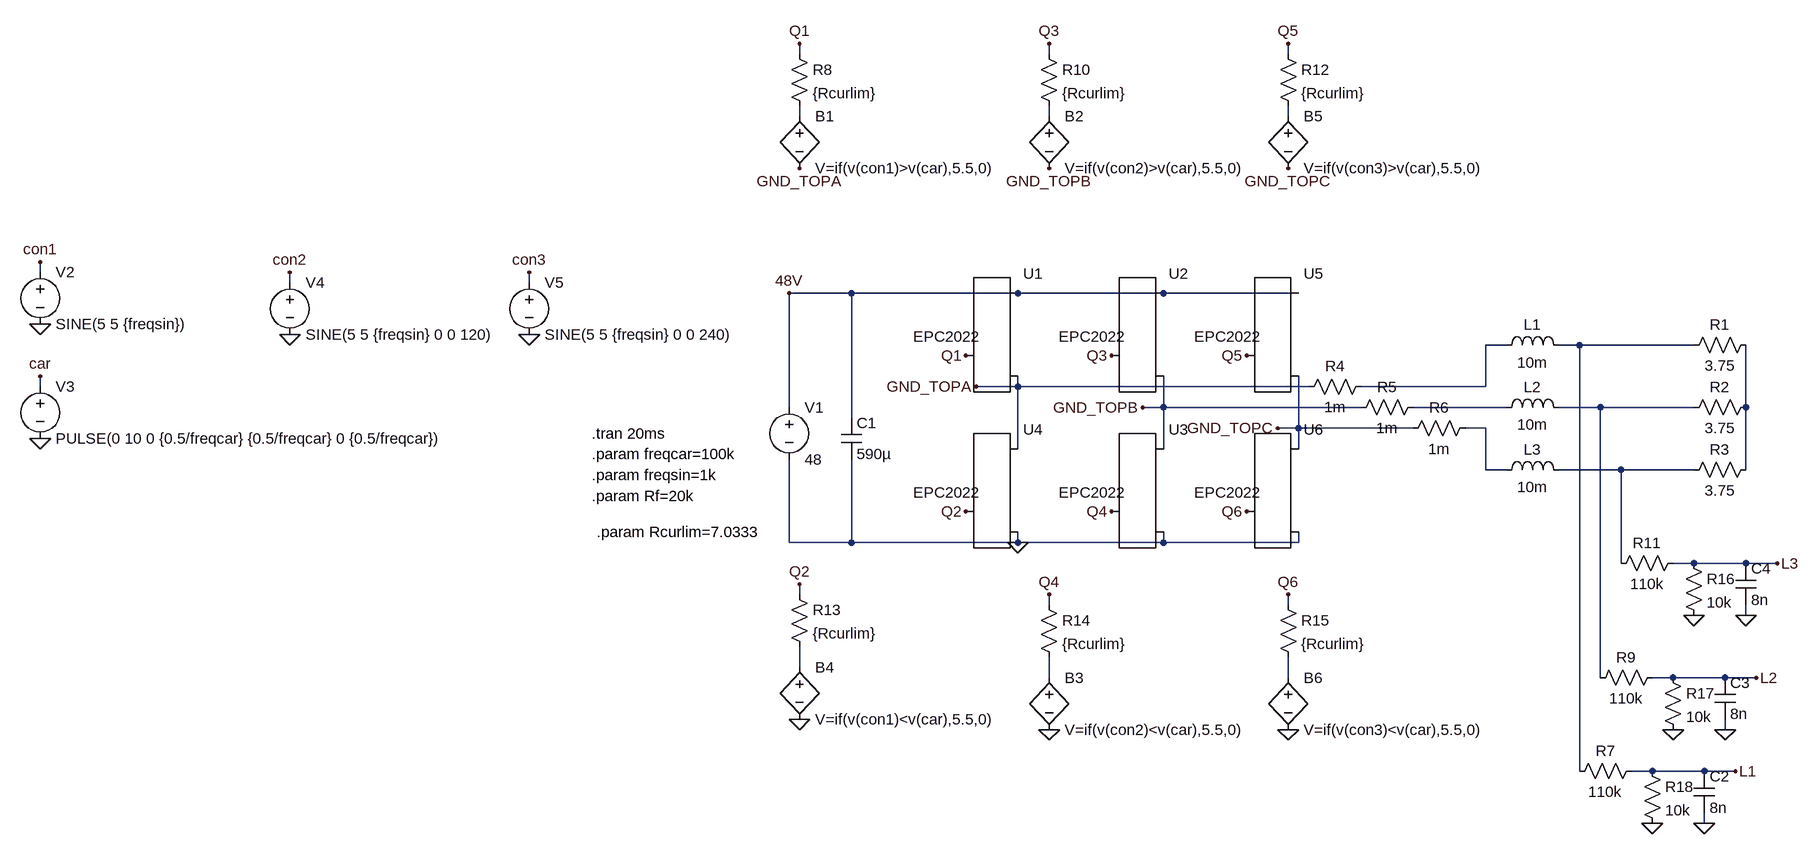
[diagram p0: schematic Threephase_EPC2022 - Kopie.asc]
Threephase_EPC2022 - Kopie.asc, the LTspice schematic file:
Version 4
SHEET 1 2244 740
WIRE -944 -560 -944 -576
WIRE -560 -560 -560 -576
WIRE -192 -560 -192 -576
WIRE -944 -464 -944 -480
WIRE -560 -464 -560 -480
WIRE -192 -464 -192 -480
WIRE -2112 -224 -2112 -240
WIRE -1728 -208 -1728 -224
WIRE -1360 -208 -1360 -224
WIRE -864 -192 -960 -192
WIRE -608 -192 -864 -192
WIRE -384 -192 -608 -192
WIRE -176 -192 -384 -192
WIRE 144 -112 112 -112
WIRE 256 -112 224 -112
WIRE 432 -112 256 -112
WIRE -2112 -48 -2112 -64
WIRE -608 -48 -608 -64
WIRE -608 -48 -672 -48
WIRE -160 -48 -608 -48
WIRE 112 -48 112 -112
WIRE 112 -48 -80 -48
WIRE -960 -16 -960 -192
WIRE -384 -16 -384 -64
WIRE -384 -16 -416 -16
WIRE -80 -16 -384 -16
WIRE 144 -16 0 -16
WIRE 288 -16 224 -16
WIRE 432 -16 288 -16
WIRE 512 -16 512 -112
WIRE -864 0 -864 -192
WIRE -176 16 -176 -64
WIRE -176 16 -208 16
WIRE 0 16 -176 16
WIRE 112 16 80 16
WIRE -608 48 -608 -48
WIRE -384 48 -384 -16
WIRE -176 48 -176 16
WIRE 112 80 112 16
WIRE 144 80 112 80
WIRE 320 80 224 80
WIRE 432 80 320 80
WIRE 512 80 512 -16
WIRE -960 192 -960 64
WIRE -864 192 -864 64
WIRE -864 192 -960 192
WIRE -608 192 -608 176
WIRE -608 192 -864 192
WIRE -384 192 -384 176
WIRE -384 192 -608 192
WIRE -176 192 -176 176
WIRE -176 192 -384 192
WIRE 320 224 320 80
WIRE 432 224 400 224
WIRE 512 224 432 224
WIRE 560 224 512 224
WIRE -944 272 -944 256
WIRE -560 288 -560 272
WIRE -192 288 -192 272
WIRE 512 304 512 288
WIRE -944 384 -944 352
WIRE -560 400 -560 368
WIRE -192 400 -192 368
WIRE 288 400 288 -16
WIRE 400 400 368 400
WIRE 480 400 400 400
WIRE 528 400 480 400
WIRE 480 480 480 464
WIRE 256 544 256 -112
WIRE 368 544 336 544
WIRE 448 544 368 544
WIRE 496 544 448 544
WIRE 448 624 448 608
FLAG -944 -576 Q1
FLAG -608 192 0
FLAG -2112 -240 con1
FLAG -2112 -64 car
FLAG -2112 -144 0
FLAG -2112 32 0
FLAG -560 -576 Q3
FLAG -560 480 0
FLAG -560 272 Q4
FLAG -944 464 0
FLAG -944 256 Q2
FLAG -688 -96 Q1
FLAG -464 -96 Q3
FLAG -688 144 Q2
FLAG -464 144 Q4
FLAG -672 -48 GND_TOPA
FLAG -960 -192 48V
FLAG -560 -384 GND_TOPB
FLAG -944 -384 GND_TOPA
FLAG -1728 -224 con2
FLAG -1728 -128 0
FLAG -416 -16 GND_TOPB
FLAG -256 -96 Q5
FLAG -256 144 Q6
FLAG -208 16 GND_TOPC
FLAG -1360 -224 con3
FLAG -192 480 0
FLAG -192 272 Q6
FLAG -1360 -128 0
FLAG -192 -384 GND_TOPC
FLAG -192 -576 Q5
FLAG 448 624 0
FLAG 496 544 L1
FLAG 480 480 0
FLAG 528 400 L2
FLAG 512 304 0
FLAG 560 224 L3
FLAG 432 304 0
FLAG 400 480 0
FLAG 368 624 0
SYMBOL bv -944 -480 R0
SYMATTR InstName B1
SYMATTR Value V=if(v(con1)>v(car),5.5,0)
SYMBOL bv -560 -480 R0
SYMATTR InstName B2
SYMATTR Value V=if(v(con2)>v(car),5.5,0)
SYMBOL cap -880 0 R0
SYMATTR InstName C1
SYMATTR Value 590µ
SYMBOL voltage -960 -32 R0
WINDOW 123 0 0 Left 0
WINDOW 39 0 0 Left 0
SYMATTR InstName V1
SYMATTR Value 48
SYMBOL voltage -2112 -240 R0
WINDOW 123 0 0 Left 0
WINDOW 39 0 0 Left 0
SYMATTR InstName V2
SYMATTR Value SINE(5 5 {freqsin})
SYMBOL voltage -2112 -64 R0
WINDOW 123 0 0 Left 0
WINDOW 39 0 0 Left 0
SYMATTR InstName V3
SYMATTR Value PULSE(0 10 0 {0.5/freqcar} {0.5/freqcar} 0 {0.5/freqcar})
SYMBOL bv -560 384 R0
SYMATTR InstName B3
SYMATTR Value V=if(v(con2)<v(car),5.5,0)
SYMBOL bv -944 368 R0
SYMATTR InstName B4
SYMATTR Value V=if(v(con1)<v(car),5.5,0)
SYMBOL EPCGaN -464 144 R0
WINDOW 3 -81 -29 Left 2
SYMATTR Value EPC2022
SYMATTR InstName U3
SYMBOL EPCGaN -688 144 R0
WINDOW 3 -81 -29 Left 2
SYMATTR Value EPC2022
SYMATTR InstName U4
SYMBOL voltage -1728 -224 R0
WINDOW 123 0 0 Left 0
WINDOW 39 0 0 Left 0
SYMATTR InstName V4
SYMATTR Value SINE(5 5 {freqsin} 0 0 120)
SYMBOL EPCGaN -256 144 R0
WINDOW 3 -81 -29 Left 2
SYMATTR Value EPC2022
SYMATTR InstName U6
SYMBOL EPCGaN -688 -96 R0
WINDOW 3 -81 -29 Left 2
SYMATTR Value EPC2022
SYMATTR InstName U1
SYMBOL EPCGaN -464 -96 R0
WINDOW 3 -81 -29 Left 2
SYMATTR Value EPC2022
SYMATTR InstName U2
SYMBOL EPCGaN -256 -96 R0
WINDOW 3 -81 -29 Left 2
SYMATTR Value EPC2022
SYMATTR InstName U5
SYMBOL bv -192 -480 R0
SYMATTR InstName B5
SYMATTR Value V=if(v(con3)>v(car),5.5,0)
SYMBOL voltage -1360 -224 R0
WINDOW 123 0 0 Left 0
WINDOW 39 0 0 Left 0
SYMATTR InstName V5
SYMATTR Value SINE(5 5 {freqsin} 0 0 240)
SYMBOL bv -192 384 R0
SYMATTR InstName B6
SYMATTR Value V=if(v(con3)<v(car),5.5,0)
SYMBOL ind 240 -96 M270
WINDOW 0 32 56 VTop 2
WINDOW 3 5 56 VBottom 2
SYMATTR InstName L1
SYMATTR Value 10m
SYMBOL ind 240 0 M270
WINDOW 0 32 56 VTop 2
WINDOW 3 5 56 VBottom 2
SYMATTR InstName L2
SYMATTR Value 10m
SYMBOL ind 240 96 M270
WINDOW 0 32 56 VTop 2
WINDOW 3 5 56 VBottom 2
SYMATTR InstName L3
SYMATTR Value 10m
SYMBOL res 416 -96 R270
WINDOW 0 32 56 VTop 2
WINDOW 3 0 56 VBottom 2
SYMATTR InstName R1
SYMATTR Value 3.75
SYMBOL res 416 0 R270
WINDOW 0 32 56 VTop 2
WINDOW 3 0 56 VBottom 2
SYMATTR InstName R2
SYMATTR Value 3.75
SYMBOL res 416 96 R270
WINDOW 0 32 56 VTop 2
WINDOW 3 0 56 VBottom 2
SYMATTR InstName R3
SYMATTR Value 3.75
SYMBOL res -64 -64 R90
WINDOW 0 0 56 VBottom 2
WINDOW 3 32 56 VTop 2
SYMATTR InstName R4
SYMATTR Value 1m
SYMBOL res 16 -32 R90
WINDOW 0 0 56 VBottom 2
WINDOW 3 32 56 VTop 2
SYMATTR InstName R5
SYMATTR Value 1m
SYMBOL res 96 0 R90
WINDOW 0 0 56 VBottom 2
WINDOW 3 32 56 VTop 2
SYMATTR InstName R6
SYMATTR Value 1m
SYMBOL res 352 528 R90
WINDOW 0 0 56 VBottom 2
WINDOW 3 32 56 VTop 2
SYMATTR InstName R7
SYMATTR Value 110k
SYMBOL cap 432 544 R0
SYMATTR InstName C2
SYMATTR Value 8n
SYMBOL res 384 384 R90
WINDOW 0 0 56 VBottom 2
WINDOW 3 32 56 VTop 2
SYMATTR InstName R9
SYMATTR Value 110k
SYMBOL cap 464 400 R0
SYMATTR InstName C3
SYMATTR Value 8n
SYMBOL res 416 208 R90
WINDOW 0 0 56 VBottom 2
WINDOW 3 32 56 VTop 2
SYMATTR InstName R11
SYMATTR Value 110k
SYMBOL cap 496 224 R0
SYMATTR InstName C4
SYMATTR Value 8n
SYMBOL res -960 -576 R0
SYMATTR InstName R8
SYMATTR Value {Rcurlim}
SYMBOL res -576 -576 R0
SYMATTR InstName R10
SYMATTR Value {Rcurlim}
SYMBOL res -208 -576 R0
SYMATTR InstName R12
SYMATTR Value {Rcurlim}
SYMBOL res -960 256 R0
SYMATTR InstName R13
SYMATTR Value {Rcurlim}
SYMBOL res -576 272 R0
SYMATTR InstName R14
SYMATTR Value {Rcurlim}
SYMBOL res -208 272 R0
SYMATTR InstName R15
SYMATTR Value {Rcurlim}
SYMBOL res 416 208 R0
SYMATTR InstName R16
SYMATTR Value 10k
SYMBOL res 384 384 R0
SYMATTR InstName R17
SYMATTR Value 10k
SYMBOL res 352 528 R0
SYMATTR InstName R18
SYMATTR Value 10k
TEXT -1264 24 Left 2 !.tran 20ms
TEXT -1264 56 Left 2 !.param freqcar=100k
TEXT -1264 88 Left 2 !.param freqsin=1k
TEXT -1264 120 Left 2 !.param Rf=20k
TEXT -1256 176 Left 2 !.param Rcurlim=7.0333

The netlist it stands for:
* Threephase_EPC2022 - Kopie.asc
B1 N001 GND_TOPA V=if(v(con1)>v(car),5.5,0)
B2 N002 GND_TOPB V=if(v(con2)>v(car),5.5,0)
C1 48V 0 590µ
V1 48V 0 48
V2 con1 0 SINE(5 5 {freqsin})
V3 car 0 PULSE(0 10 0 {0.5/freqcar} {0.5/freqcar} 0 {0.5/freqcar})
B3 N012 0 V=if(v(con2)<v(car),5.5,0)
B4 N011 0 V=if(v(con1)<v(car),5.5,0)
XU3 Q4 GND_TOPB 0 EPC2022
XU4 Q2 GND_TOPA 0 EPC2022
V4 con2 0 SINE(5 5 {freqsin} 0 0 120)
XU6 Q6 GND_TOPC 0 EPC2022
XU1 Q1 48V GND_TOPA EPC2022
XU2 Q3 48V GND_TOPB EPC2022
XU5 Q5 48V GND_TOPC EPC2022
B5 N003 GND_TOPC V=if(v(con3)>v(car),5.5,0)
V5 con3 0 SINE(5 5 {freqsin} 0 0 240)
B6 N013 0 V=if(v(con3)<v(car),5.5,0)
L1 N005 N004 10m
L2 N007 N006 10m
L3 N010 N009 10m
R1 N005 N008 3.75
R2 N007 N008 3.75
R3 N010 N008 3.75
R4 N004 GND_TOPA 1m
R5 N006 GND_TOPB 1m
R6 N009 GND_TOPC 1m
R7 L1 N005 110k
C2 L1 0 8n
R9 L2 N007 110k
C3 L2 0 8n
R11 L3 N010 110k
C4 L3 0 8n
R8 Q1 N001 {Rcurlim}
R10 Q3 N002 {Rcurlim}
R12 Q5 N003 {Rcurlim}
R13 Q2 N011 {Rcurlim}
R14 Q4 N012 {Rcurlim}
R15 Q6 N013 {Rcurlim}
R16 L3 0 10k
R17 L2 0 10k
R18 L1 0 10k
.tran 20ms
.param freqcar=100k
.param freqsin=1k
.param Rf=20k
.param Rcurlim=7.0333
.backanno
.end